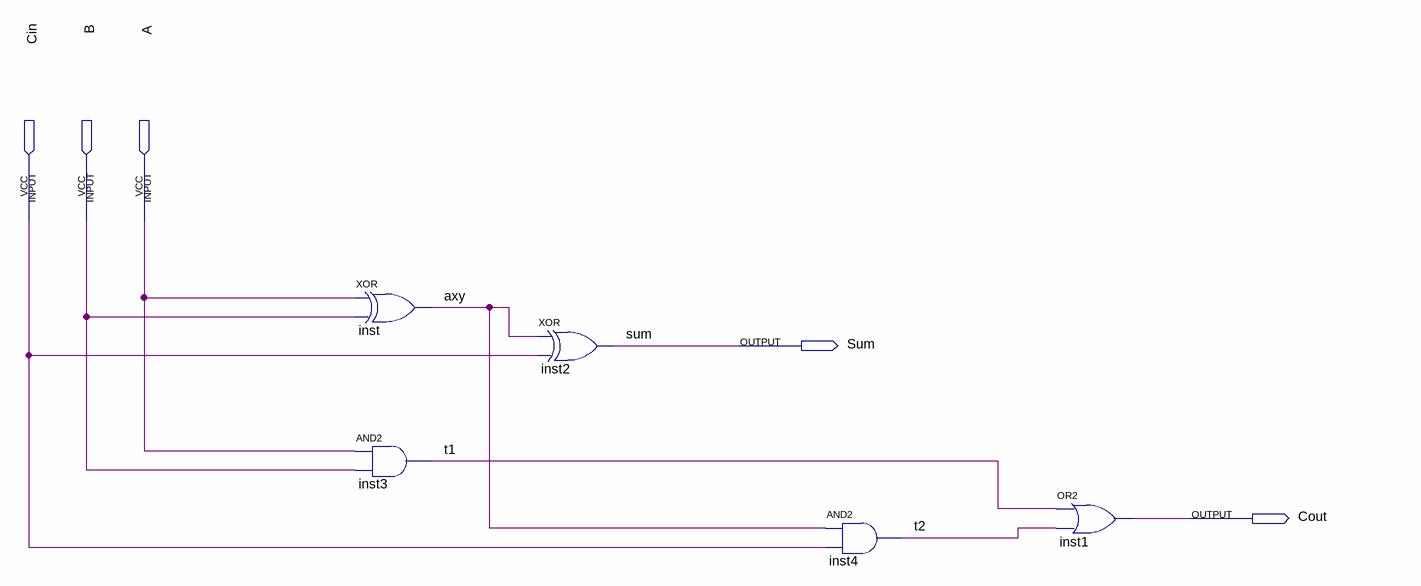
[diagram p0: schematic sheet]
// Quartus schematic FA.bdf as structural Verilog: 5 symbols, 5 pins
module FA (
  input  Cin,
  input  B,
  input  A,
  output Sum,
  output Cout
);

  wire axy, t1, t2;

  xor inst (axy, A, B);
  and inst3 (t1, A, B);
  xor inst2 (Sum, axy, Cin);
  and inst4 (t2, axy, Cin);
  or inst1 (Cout, t1, t2);
endmodule
